# EAGLE design encoder_board (EAGLE 8.5.0)
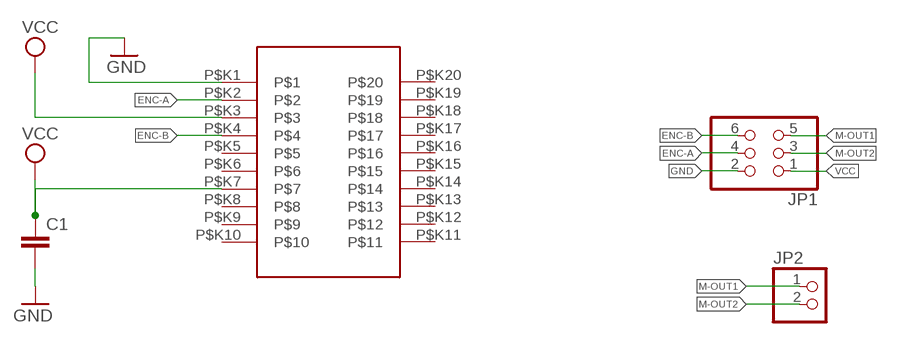
[diagram p0: schematic, sheet 1]

## Parts
C1  C-EUC0805K  [C0805K]
JP1  PINHD-2X3  [2X03]
JP2  PINHD-1X2  [1X02]
U$1  TSSOP20  [TSSOP20]

## Nets
ENC-A: JP1.4 U$1.P$K2
ENC-B: JP1.6 U$1.P$K4
GND: C1.2 JP1.2 U$1.P$K1
M-OUT1: JP1.5 JP2.1
M-OUT2: JP1.3 JP2.2
VCC: C1.1 JP1.1 U$1.P$K3 U$1.P$K7
Unconnected: U$1.P$K5 U$1.P$K6 U$1.P$K8 U$1.P$K9 U$1.P$K10 U$1.P$K11 U$1.P$K12 U$1.P$K13 U$1.P$K14 U$1.P$K15 U$1.P$K16 U$1.P$K17 U$1.P$K18 U$1.P$K19 U$1.P$K20

## Library data of the parts
C1 = rcl:C-EU: CAPACITOR, European symbol; SPICEPREFIX: C
JP1 = pinhead:PINHD-2X3: PIN HEADER
JP2 = pinhead:PINHD-1X2: PIN HEADER
U$1 = tssop20:TSSOP20

## Board
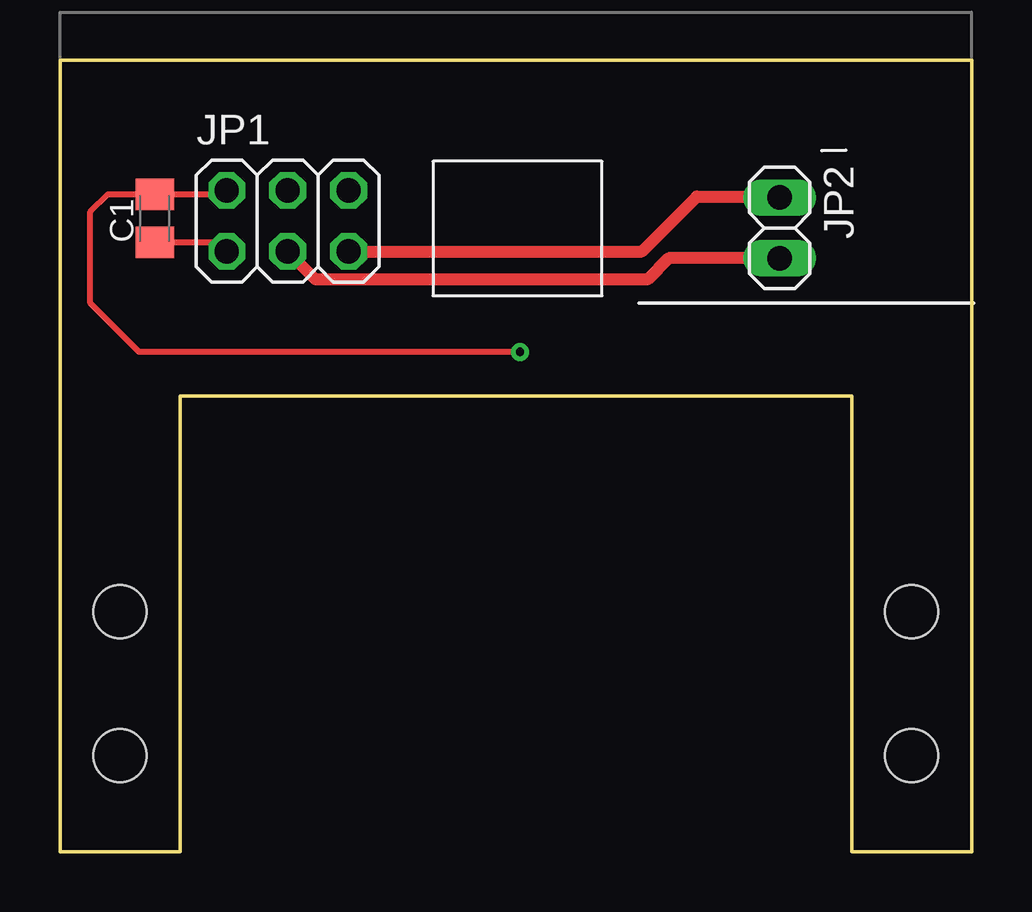
[diagram p1: board, top side]
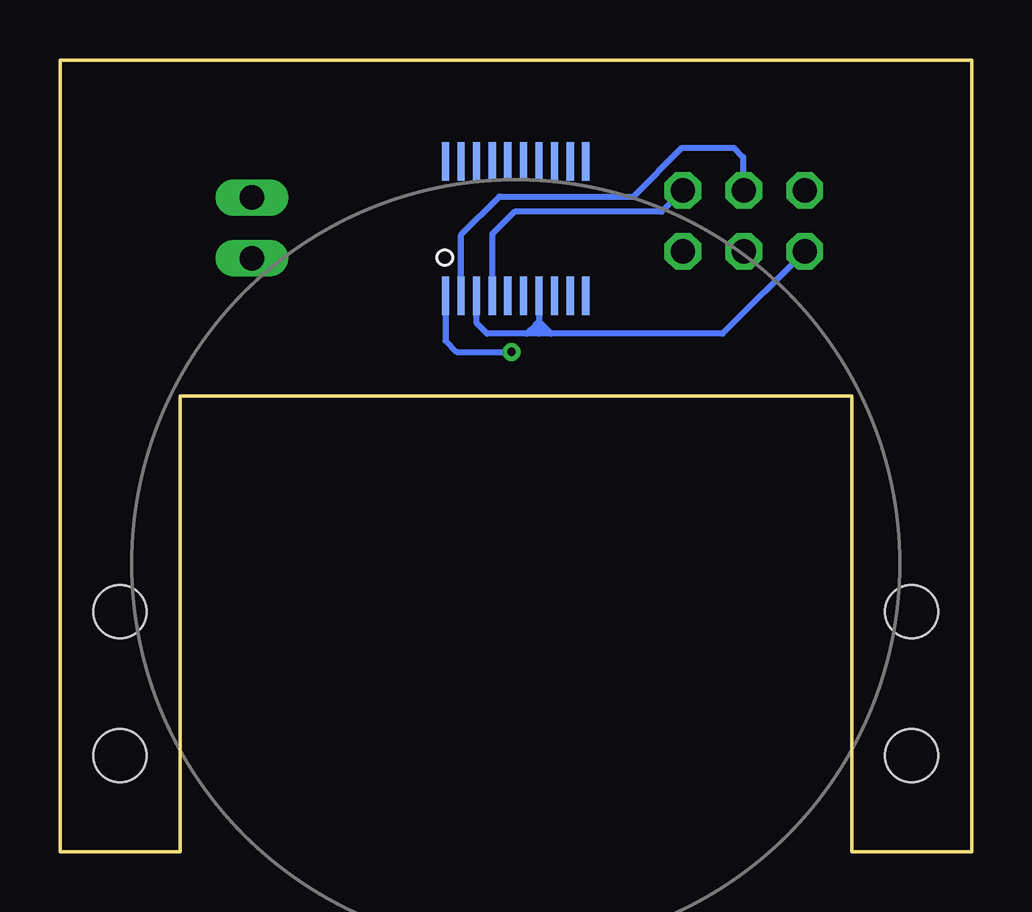
[diagram p2: board, bottom side, seen from below]

Size 38 x 33 mm. Coordinates in mm from the lower left corner, seen from the top.
Outline: 0,0 5,0 5,19 33,19 33,0 38,0 38,33 0,33 0,0
Copper layers (1*16): Top 0.035mm / dielectric 1.5mm / Bottom 0.035mm
Design rules "default": minimum track width 6mil, minimum drill 0.35mm, track to track 6mil, track to pad 6mil, pad to pad 6mil, via to via 6mil, smd to smd 6mil, copper to edge 40mil, drill to drill 6mil, minimum pad ring 10mil, minimum via ring 8mil, stop-mask expansion 4mil, vias tented up to drill 0mil, thermal gap 10mil
Holes 2.2 mm at 2.5,4 35.5,4 2.5,10 35.5,10

### Footprints (pad centres in the part's own frame; a part is rotated, then mirrored left to right if it is on the bottom)
C0805K = smd 1.3 x 1.6: 1 -1,0; 2 1,0
2X03 = drill 1.016 octagon: 1 -2.54,-1.27; 2 -2.54,1.27; 3 0,-1.27; 4 0,1.27; 5 2.54,-1.27; 6 2.54,1.27
1X02 = drill 1.016 long: 1 -1.27,0; 2 1.27,0
TSSOP20 = smd 0.3 x 1.6: P$K1 -2.93,-2.825; P$K2 -2.28,-2.825; P$K3 -1.63,-2.825; P$K4 -0.98,-2.825; P$K5 -0.33,-2.825; P$K6 0.32,-2.825; P$K7 0.97,-2.825; P$K8 1.62,-2.825; P$K9 2.27,-2.825; P$K10 2.92,-2.825; P$K11 2.92,2.775; P$K12 2.27,2.775; P$K13 1.62,2.775; P$K14 0.97,2.775; P$K15 0.32,2.775; P$K16 -0.33,2.775; P$K17 -0.98,2.775; P$K18 -1.63,2.775; P$K19 -2.28,2.775; P$K20 -2.93,2.775

### Placement (x,y rotation side)
C1  3.95,26.4 90 top
JP1  9.49,26.29 0 top
JP2  30,26 270 top
U$1  19,26 0 bottom

### Tracks (layer width: path | path; a pad name or v marks a point on that pad's centre or on a via)
ENC-A
  Bottom 0.254: U$1.P$K2 21.28,25.71 19.68,27.3 14.1,27.3 12.06,29.34 9.91,29.34 9.53,28.96 9.53,27.59 JP1.4
ENC-B
  Bottom 0.254: JP1.6 12.92,26.67 19.05,26.67 19.98,25.74 U$1.P$K4
GND  (via drill 0.35)
  Top 0.254: v19.18,20.83 3.3,20.83 1.27,22.86 1.27,26.67 2,27.4 C1.2 6.79,27.4 JP1.2
  Bottom 0.254: U$1.P$K1 21.93,21.3 21.46,20.83 v19.18,20.83
M-OUT1
  Top 0.508: JP1.5 24.26,25.02 26.54,27.3 29.96,27.3 JP2.1
M-OUT2
  Top 0.508: JP2.2 25.36,24.73 24.49,23.85 10.66,23.85 JP1.3
VCC
  Top 0.254: C1.1 6.57,25.4 JP1.1
  Bottom 0.254: JP1.1 10.38,21.59 17.53,21.59 | 17.53,21.59 18.03,21.59 | U$1.P$K3 20.63,22.03 20.19,21.59 18.54,21.59 | U$1.P$K7 18.03,21.59 | 18.03,21.59 18.54,21.59 | 18.16,21.97 18.54,21.59 | 18.03,21.97 18.16,21.97 | 18.16,21.97 18.03,22.1 | 18.03,22.1 18.03,21.97 | 18.16,21.72 18.03,21.84 | 18.03,21.97 18.03,21.84 | 18.03,21.84 17.91,21.72 17.65,21.72 | 17.65,21.72 18.03,22.1 | 17.65,21.72 17.53,21.59